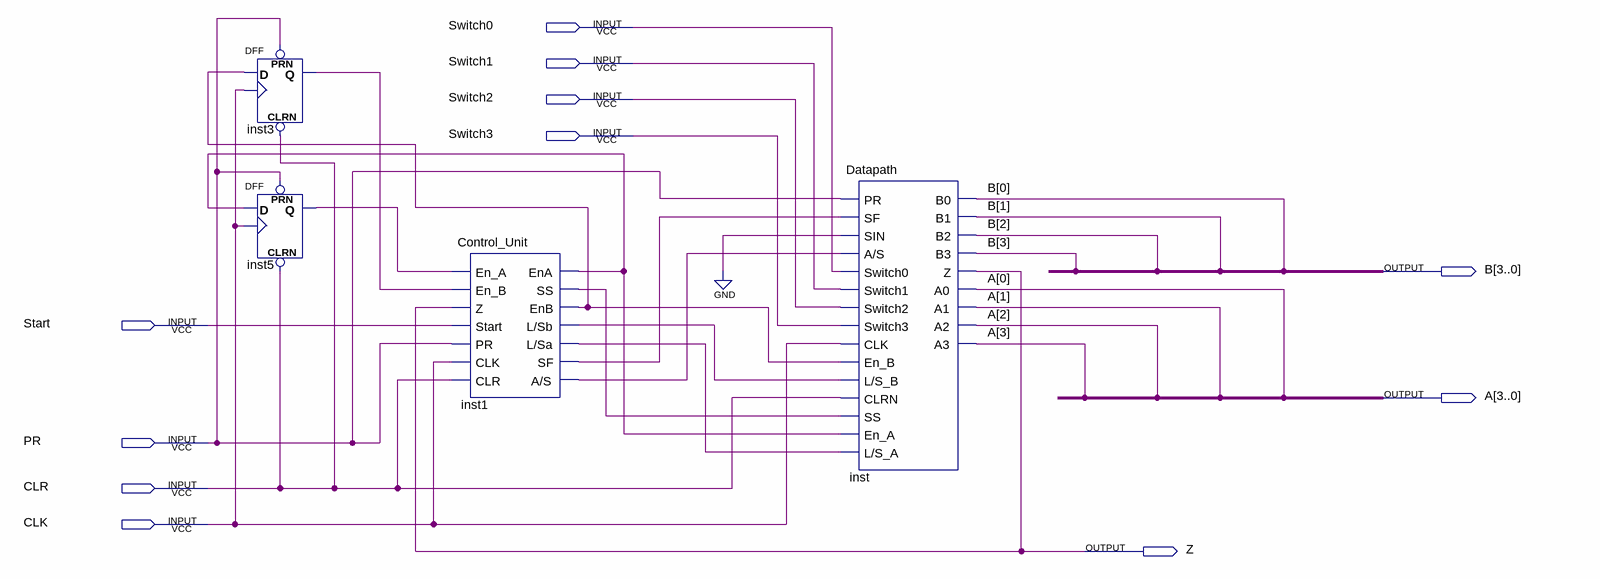
[diagram p0: schematic sheet]
// Quartus schematic Processor.bdf as structural Verilog: 4 symbols, 11 pins
module Processor (
  input  Switch0,
  input  Switch1,
  input  Switch2,
  input  Switch3,
  input  Start,
  input  PR,
  input  CLR,
  input  CLK,
  output [3:0] B,
  output [3:0] A,
  output Z
);

  wire inst1_a_s, inst1_ena, inst1_enb, inst1_l_sa, inst1_l_sb, inst1_sf, inst1_ss, inst3_q, inst5_q;

  DFF inst3 (.CLRN(CLR), .CLK(CLK), .D(inst1_enb), .PRN(PR), .Q(inst3_q));
  DFF inst5 (.CLRN(CLR), .CLK(CLK), .D(inst1_ena), .PRN(PR), .Q(inst5_q));
  Control_Unit inst1 (
    .En_A(inst5_q), .En_B(inst3_q), .Z(Z), .Start(Start), .PR(PR), .CLK(CLK), .CLR(CLR), .EnA(inst1_ena),
    .SS(inst1_ss), .EnB(inst1_enb), .\L/Sb (inst1_l_sb), .\L/Sa (inst1_l_sa), .SF(inst1_sf), .\A/S (inst1_a_s));
  Datapath inst (
    .PR(PR), .SF(inst1_sf), .SIN(1'b0), .\A/S (inst1_a_s), .Switch0(Switch0), .Switch1(Switch1),
    .Switch2(Switch2), .Switch3(Switch3), .CLK(CLK), .En_B(inst1_enb), .\L/S_B (inst1_l_sb), .CLRN(CLR),
    .SS(inst1_ss), .En_A(inst1_ena), .\L/S_A (inst1_l_sa), .B0(B[0]), .B1(B[1]), .B2(B[2]), .B3(B[3]), .Z(Z),
    .A0(A[0]), .A1(A[1]), .A2(A[2]), .A3(A[3]));
endmodule
